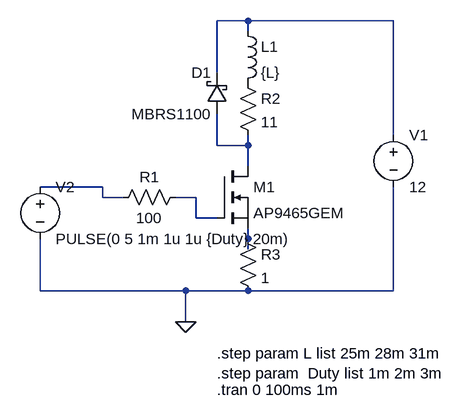
[diagram p0: schematic SolDrive4.asc]
SolDrive4.asc, the LTspice schematic file:
Version 4
SHEET 1 956 680
WIRE 416 80 368 80
WIRE 640 80 416 80
WIRE 416 96 416 80
WIRE 368 160 368 80
WIRE 640 256 640 80
WIRE 368 272 368 224
WIRE 416 272 416 256
WIRE 416 272 368 272
WIRE 416 304 416 272
WIRE 192 336 96 336
WIRE 192 352 192 336
WIRE 224 352 192 352
WIRE 336 352 304 352
WIRE 336 384 336 352
WIRE 368 384 336 384
WIRE 416 416 416 400
WIRE 416 432 416 416
WIRE 96 496 96 416
WIRE 320 496 96 496
WIRE 416 496 320 496
WIRE 640 496 640 336
WIRE 640 496 416 496
WIRE 320 544 320 496
FLAG 320 544 0
SYMBOL nmos 368 304 R0
SYMATTR InstName M1
SYMATTR Value AP9465GEM
SYMBOL ind 400 80 R0
SYMATTR InstName L1
SYMATTR Value {L}
SYMATTR SpiceLine Rser=1
SYMBOL schottky 384 224 R180
WINDOW 0 24 64 Left 2
WINDOW 3 24 0 Left 2
SYMATTR InstName D1
SYMATTR Value MBRS1100
SYMATTR Description Diode
SYMATTR Type diode
SYMBOL Res 208 368 R270
WINDOW 0 32 56 VTop 2
WINDOW 3 0 56 VBottom 2
SYMATTR InstName R1
SYMATTR Value 100
SYMBOL voltage 640 240 R0
SYMATTR InstName V1
SYMATTR Value 12
SYMBOL voltage 96 320 R0
SYMATTR InstName V2
SYMATTR Value PULSE(0 5 1m 1u 1u {Duty} 20m)
SYMBOL Res 400 160 R0
SYMATTR InstName R2
SYMATTR Value 11
SYMBOL Res 400 400 R0
SYMATTR InstName R3
SYMATTR Value 1
TEXT 368 648 Left 2 !.tran 0 100ms 1m
TEXT 368 592 Left 2 !.step param L list 25m 28m 31m\n.step param  Duty list 1m 2m 3m

The netlist it stands for:
* SolDrive4.asc
M1 N002 N004 N005 N005 AP9465GEM
L1 N001 P001 {L} Rser=1
D1 N002 N001 MBRS1100
R1 N003 N004 100
V1 N001 0 12
V2 N003 0 PULSE(0 5 1m 1u 1u {Duty} 20m)
R2 P001 N002 11
R3 N005 0 1
.model D D
.lib standard.dio
.model NMOS NMOS
.model PMOS PMOS
.lib standard.mos
.tran 0 100ms 1m
.step param L list 25m 28m 31m
.step param  Duty list 1m 2m 3m
.backanno
.end